# Altium schematic sheet top.SchDoc
size A3
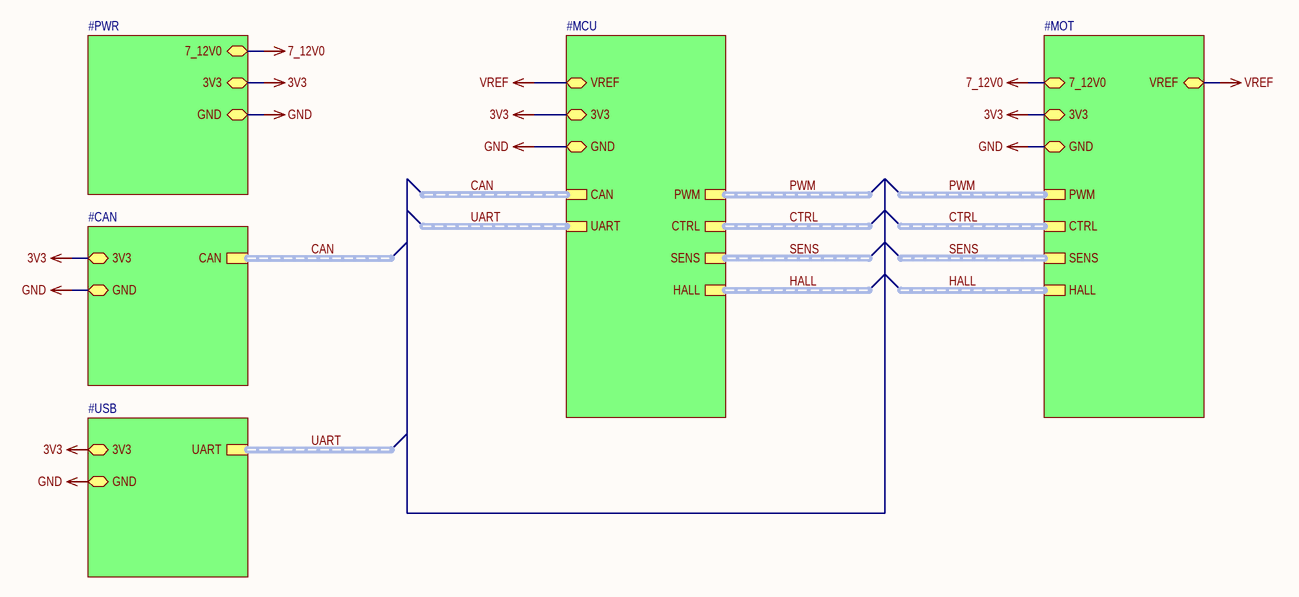
[diagram p0: top.SchDoc]

## Sub-sheets
#CAN = can.SchDoc: 3V3 (bidir), GND (bidir), CAN (harness UART)
#MCU = mcu.SchDoc: GND (bidir), 3V3 (bidir), CAN (harness UART), UART (harness UART), PWM (harness UART), CTRL (harness UART), SENS (harness UART), HALL (harness UART), VREF (bidir)
#MOT = motor.SchDoc: 7_12V0 (bidir), 3V3 (bidir), GND (bidir), SENS (harness UART), CTRL (harness UART), HALL (harness UART), PWM (harness UART), VREF (bidir)
#PWR = power.SchDoc: 3V3 (bidir), GND (bidir), 7_12V0 (bidir)
#USB = usb.SchDoc: 3V3 (bidir), GND (bidir), UART (harness UART)

## Nets
3V3: sheet #PWR/3V3, sheet #CAN/3V3, sheet #USB/3V3, sheet #MCU/3V3, sheet #MOT/3V3
7_12V0: sheet #PWR/7_12V0, sheet #MOT/7_12V0
GND: sheet #PWR/GND, sheet #CAN/GND, sheet #USB/GND, sheet #MCU/GND, sheet #MOT/GND
VREF: sheet #MCU/VREF, sheet #MOT/VREF

## Buses and harness runs
harness CAN = sheet #CAN/CAN
harness CAN = sheet #MCU/CAN
harness CTRL = sheet #MCU/CTRL
harness CTRL = sheet #MOT/CTRL
harness HALL = sheet #MCU/HALL
harness HALL = sheet #MOT/HALL
harness PWM = sheet #MCU/PWM
harness PWM = sheet #MOT/PWM
harness SENS = sheet #MCU/SENS
harness SENS = sheet #MOT/SENS
harness UART = sheet #MCU/UART
harness UART = sheet #USB/UART